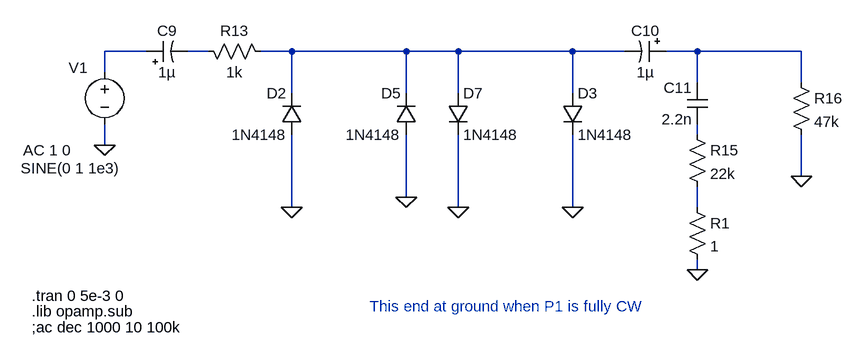
[diagram p0: schematic Klon-Centaur_diodes_w_filter_v4.asc]
Klon-Centaur_diodes_w_filter_v4.asc, the LTspice schematic file:
Version 4
SHEET 1 4496 5064
WIRE 960 2544 896 2544
WIRE 1056 2544 1024 2544
WIRE 1184 2544 1136 2544
WIRE 1360 2544 1184 2544
WIRE 1440 2544 1360 2544
WIRE 1616 2544 1440 2544
WIRE 1696 2544 1616 2544
WIRE 1808 2544 1760 2544
WIRE 1968 2544 1808 2544
WIRE 896 2576 896 2544
WIRE 1808 2592 1808 2544
WIRE 1968 2592 1968 2544
WIRE 1184 2608 1184 2544
WIRE 1360 2608 1360 2544
WIRE 1440 2608 1440 2544
WIRE 1616 2608 1616 2544
WIRE 1808 2672 1808 2656
WIRE 896 2688 896 2656
WIRE 1968 2736 1968 2672
WIRE 1360 2768 1360 2672
WIRE 1184 2784 1184 2672
WIRE 1440 2784 1440 2672
WIRE 1616 2784 1616 2672
WIRE 1808 2784 1808 2752
WIRE 1808 2880 1808 2864
FLAG 1616 2784 0
FLAG 1184 2784 0
FLAG 896 2688 0
FLAG 1808 2880 0
FLAG 1968 2736 0
FLAG 1360 2768 0
FLAG 1440 2784 0
SYMBOL voltage 896 2560 R0
WINDOW 0 -55 9 Left 2
WINDOW 123 -125 136 Left 2
WINDOW 39 0 0 Left 0
WINDOW 3 -129 164 Left 2
SYMATTR InstName V1
SYMATTR Value2 AC 1 0
SYMATTR Value SINE(0 1 1e3)
SYMBOL res 1152 2560 M270
WINDOW 0 32 56 VTop 2
WINDOW 3 0 56 VBottom 2
SYMATTR InstName R13
SYMATTR Value 1k
SYMBOL cap 1824 2592 M0
SYMATTR InstName C11
SYMATTR Value 2.2n
SYMBOL res 1792 2656 R0
SYMATTR InstName R15
SYMATTR Value 22k
SYMBOL diode 1200 2672 R180
WINDOW 0 24 64 Left 2
WINDOW 3 24 0 Left 2
SYMATTR InstName D2
SYMATTR Value 1N4148
SYMBOL diode 1600 2608 R0
SYMATTR InstName D3
SYMATTR Value 1N4148
SYMBOL polcap 960 2560 R270
WINDOW 0 32 32 VTop 2
WINDOW 3 0 32 VBottom 2
SYMATTR InstName C9
SYMATTR Value 1µ
SYMBOL polcap 1760 2528 R90
WINDOW 0 0 32 VBottom 2
WINDOW 3 32 32 VTop 2
SYMATTR InstName C10
SYMATTR Value 1µ
SYMBOL res 1792 2768 R0
SYMATTR InstName R1
SYMATTR Value 1
SYMBOL res 1952 2576 R0
SYMATTR InstName R16
SYMATTR Value 47k
SYMBOL diode 1376 2672 R180
WINDOW 0 24 64 Left 2
WINDOW 3 24 0 Left 2
SYMATTR InstName D5
SYMATTR Value 1N4148
SYMBOL diode 1424 2608 R0
SYMATTR InstName D7
SYMATTR Value 1N4148
TEXT 784 2944 Left 2 !.lib opamp.sub
TEXT 784 2968 Left 2 !;ac dec 1000 10 100k
TEXT 1304 2936 Left 2 ;This end at ground when P1 is fully CW
TEXT 784 2920 Left 2 !.tran 0 5e-3 0

The netlist it stands for:
* Klon-Centaur_diodes_w_filter_v4.asc
V1 N001 0 SINE(0 1 1e3) AC 1 0
R13 N003 N002 1k
C11 N004 N005 2.2n
R15 N005 N006 22k
D2 0 N003 1N4148
D3 N003 0 1N4148
C9 N001 N002 1µ
C10 N004 N003 1µ
R1 N006 0 1
R16 N004 0 47k
D5 0 N003 1N4148
D7 N003 0 1N4148
.model D D
.lib standard.dio
.lib opamp.sub
;ac dec 1000 10 100k
* This end at ground when P1 is fully CW
.tran 0 5e-3 0
.backanno
.end